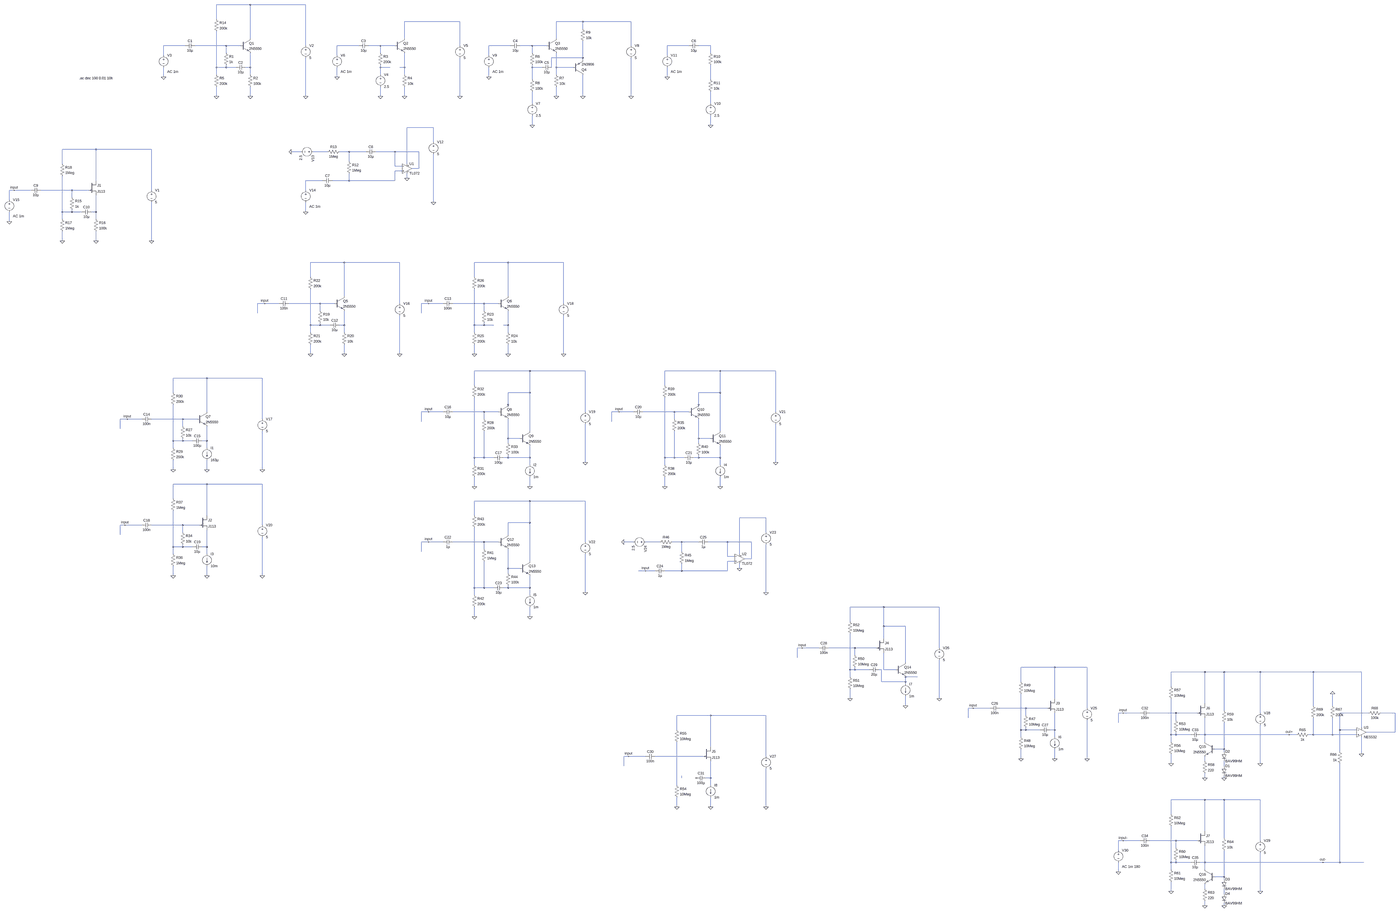
[diagram p0: schematic discrete_input.asc, whole sheet]
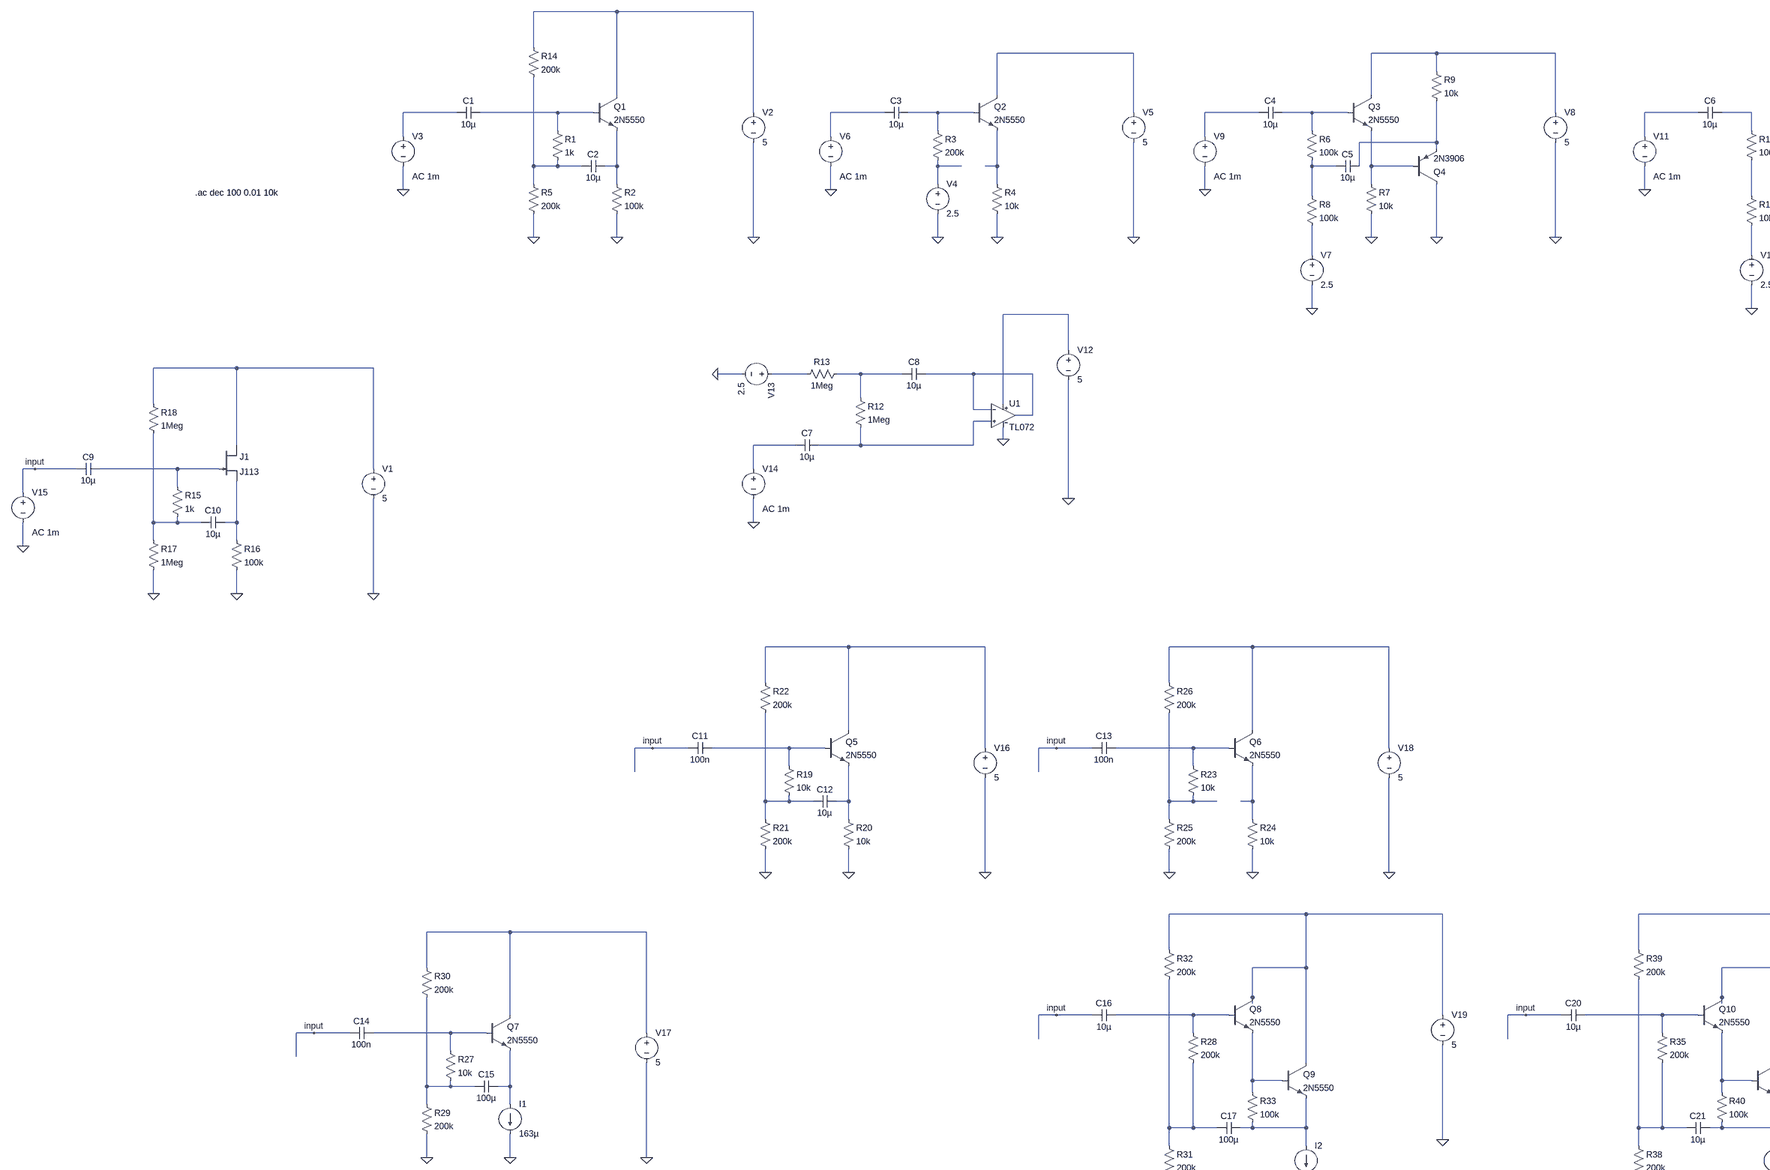
[diagram p1: schematic discrete_input.asc, part, row 1 of 2, column 1 of 2]
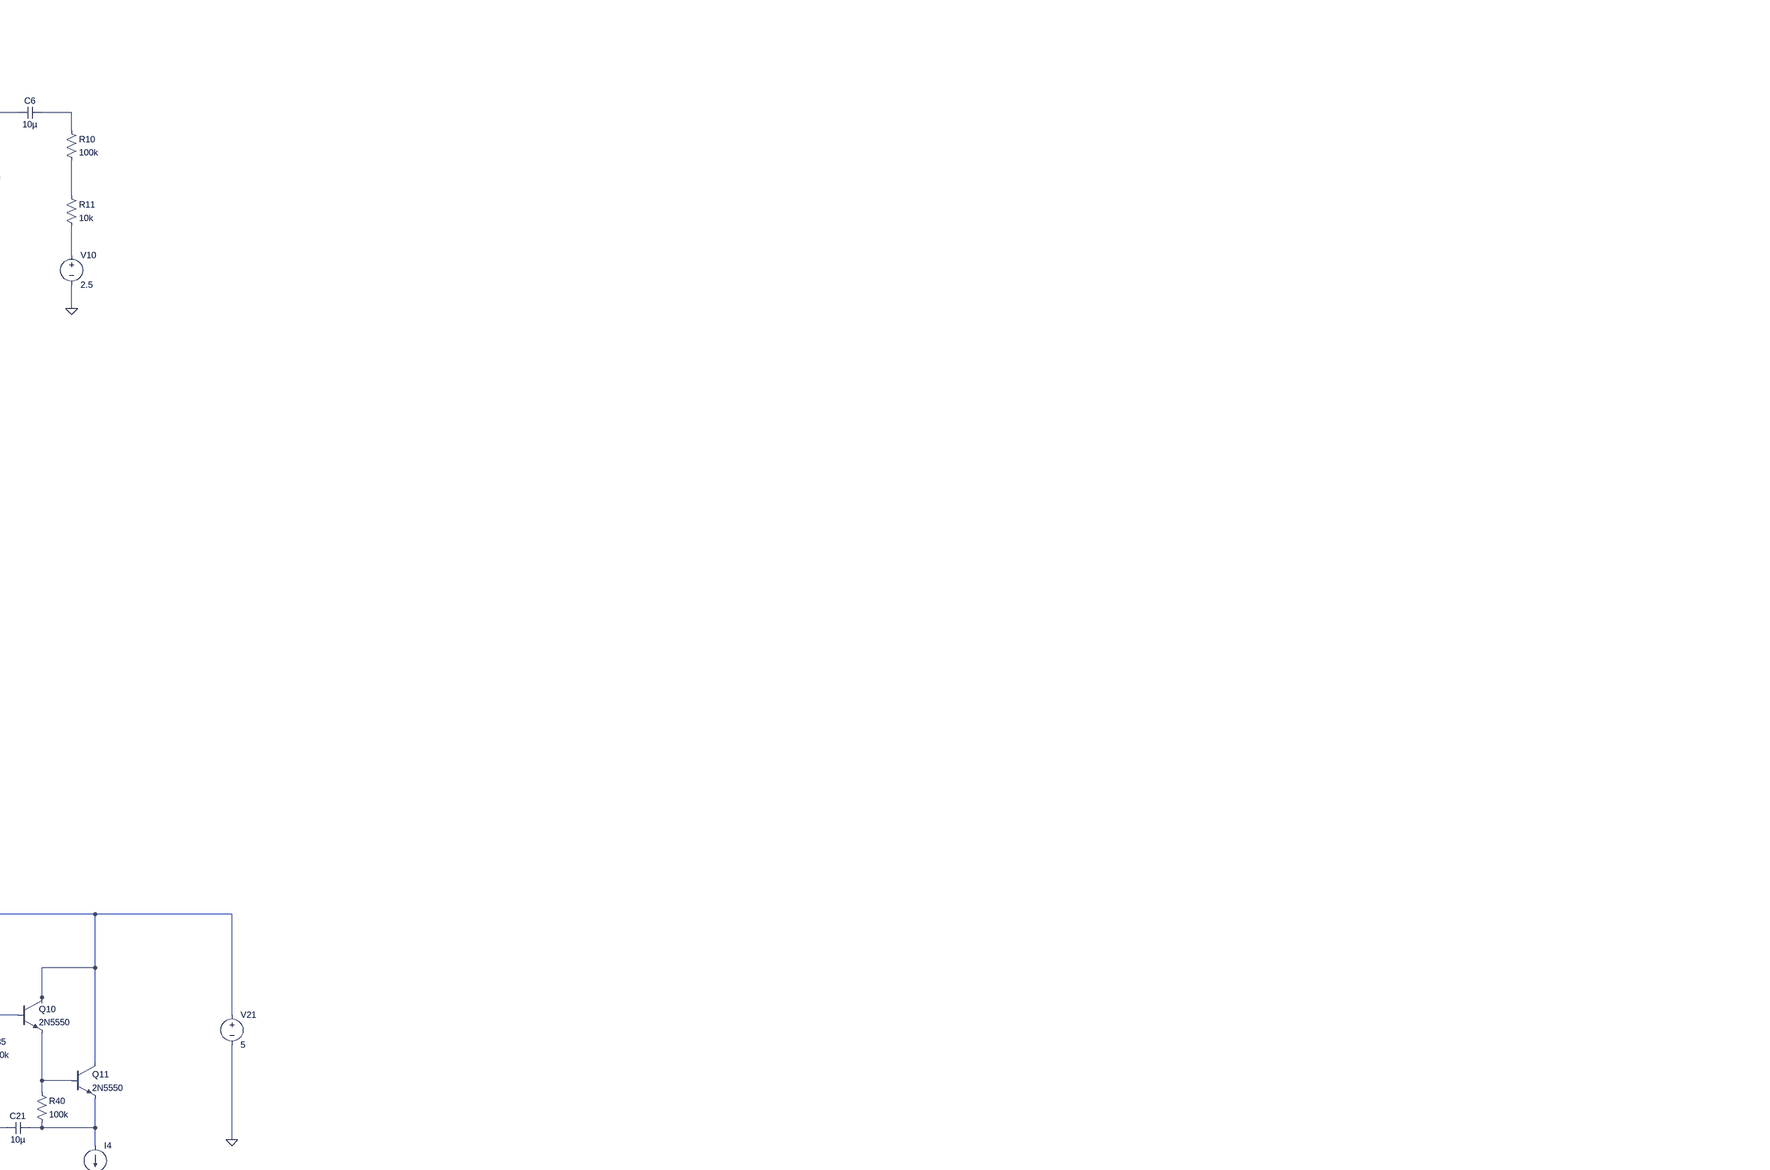
[diagram p2: schematic discrete_input.asc, part, row 1 of 2, column 2 of 2]
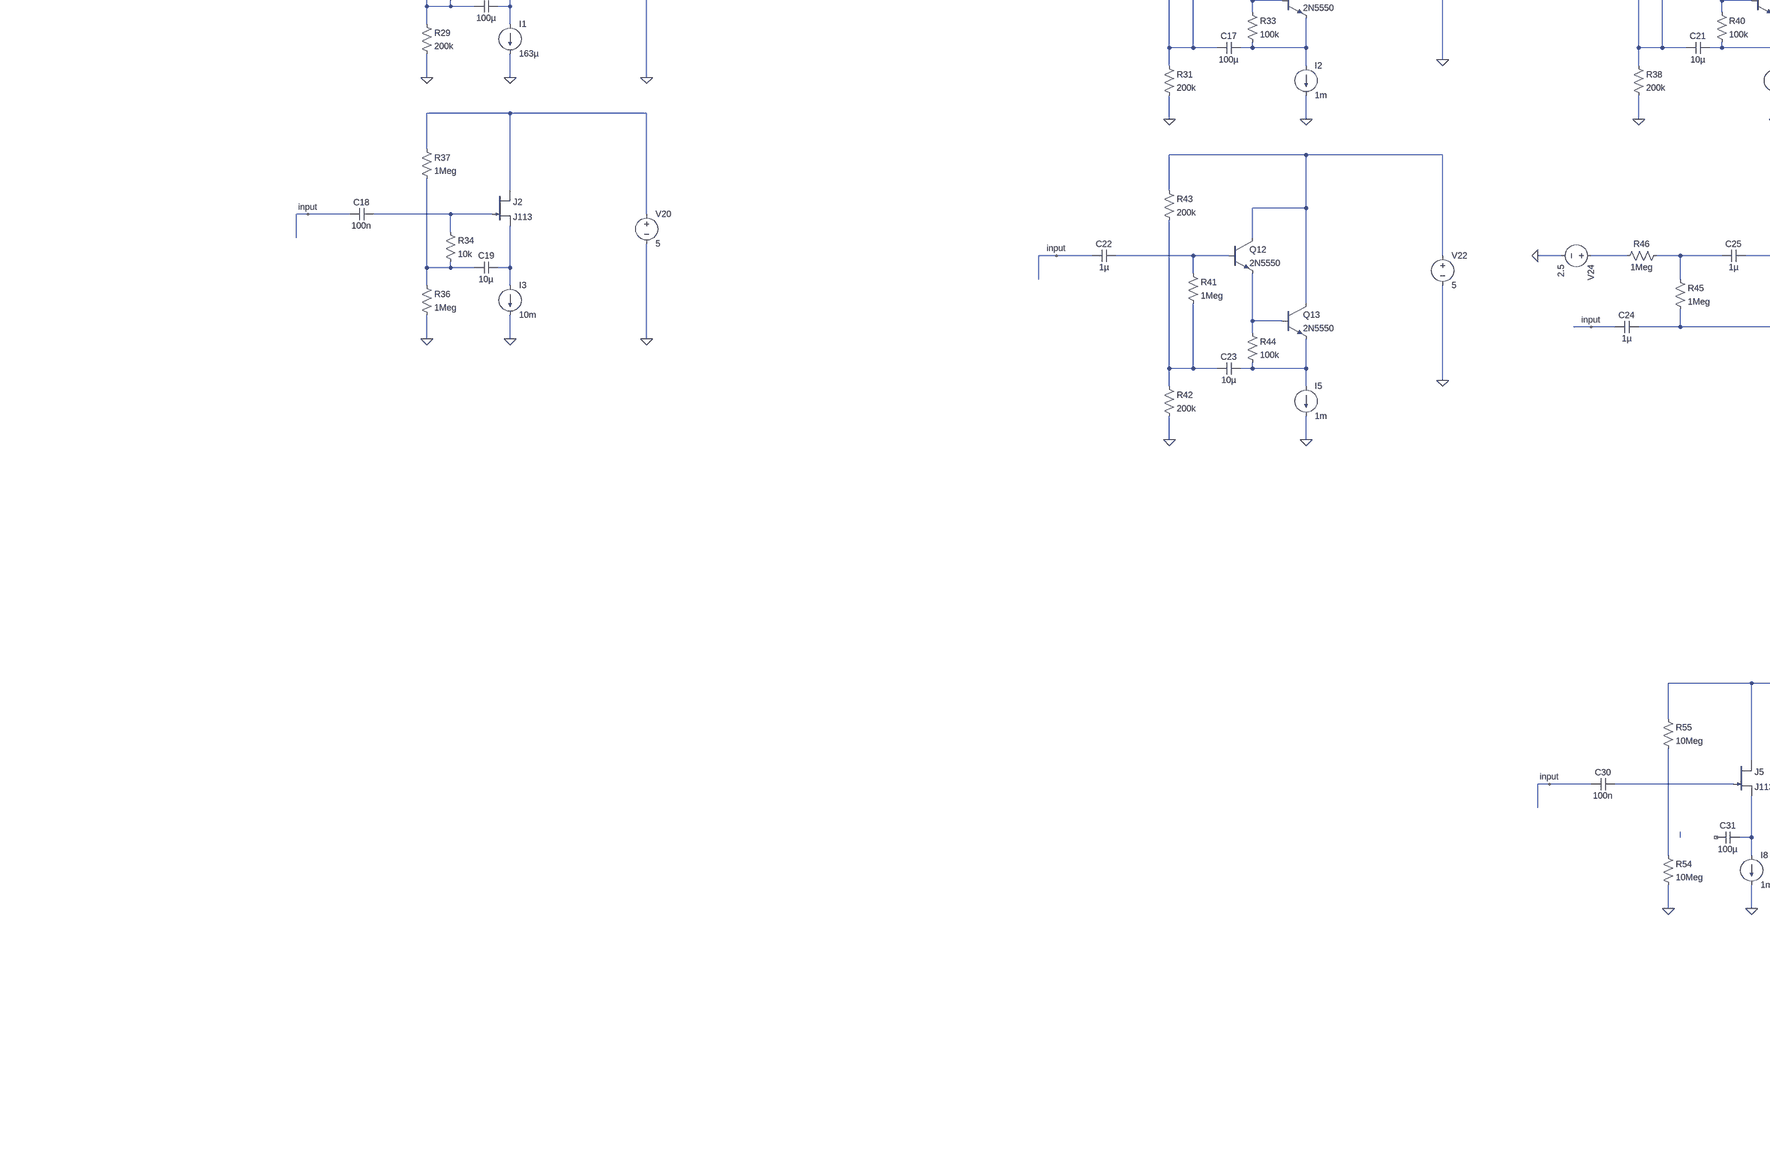
[diagram p3: schematic discrete_input.asc, part, row 2 of 2, column 1 of 2]
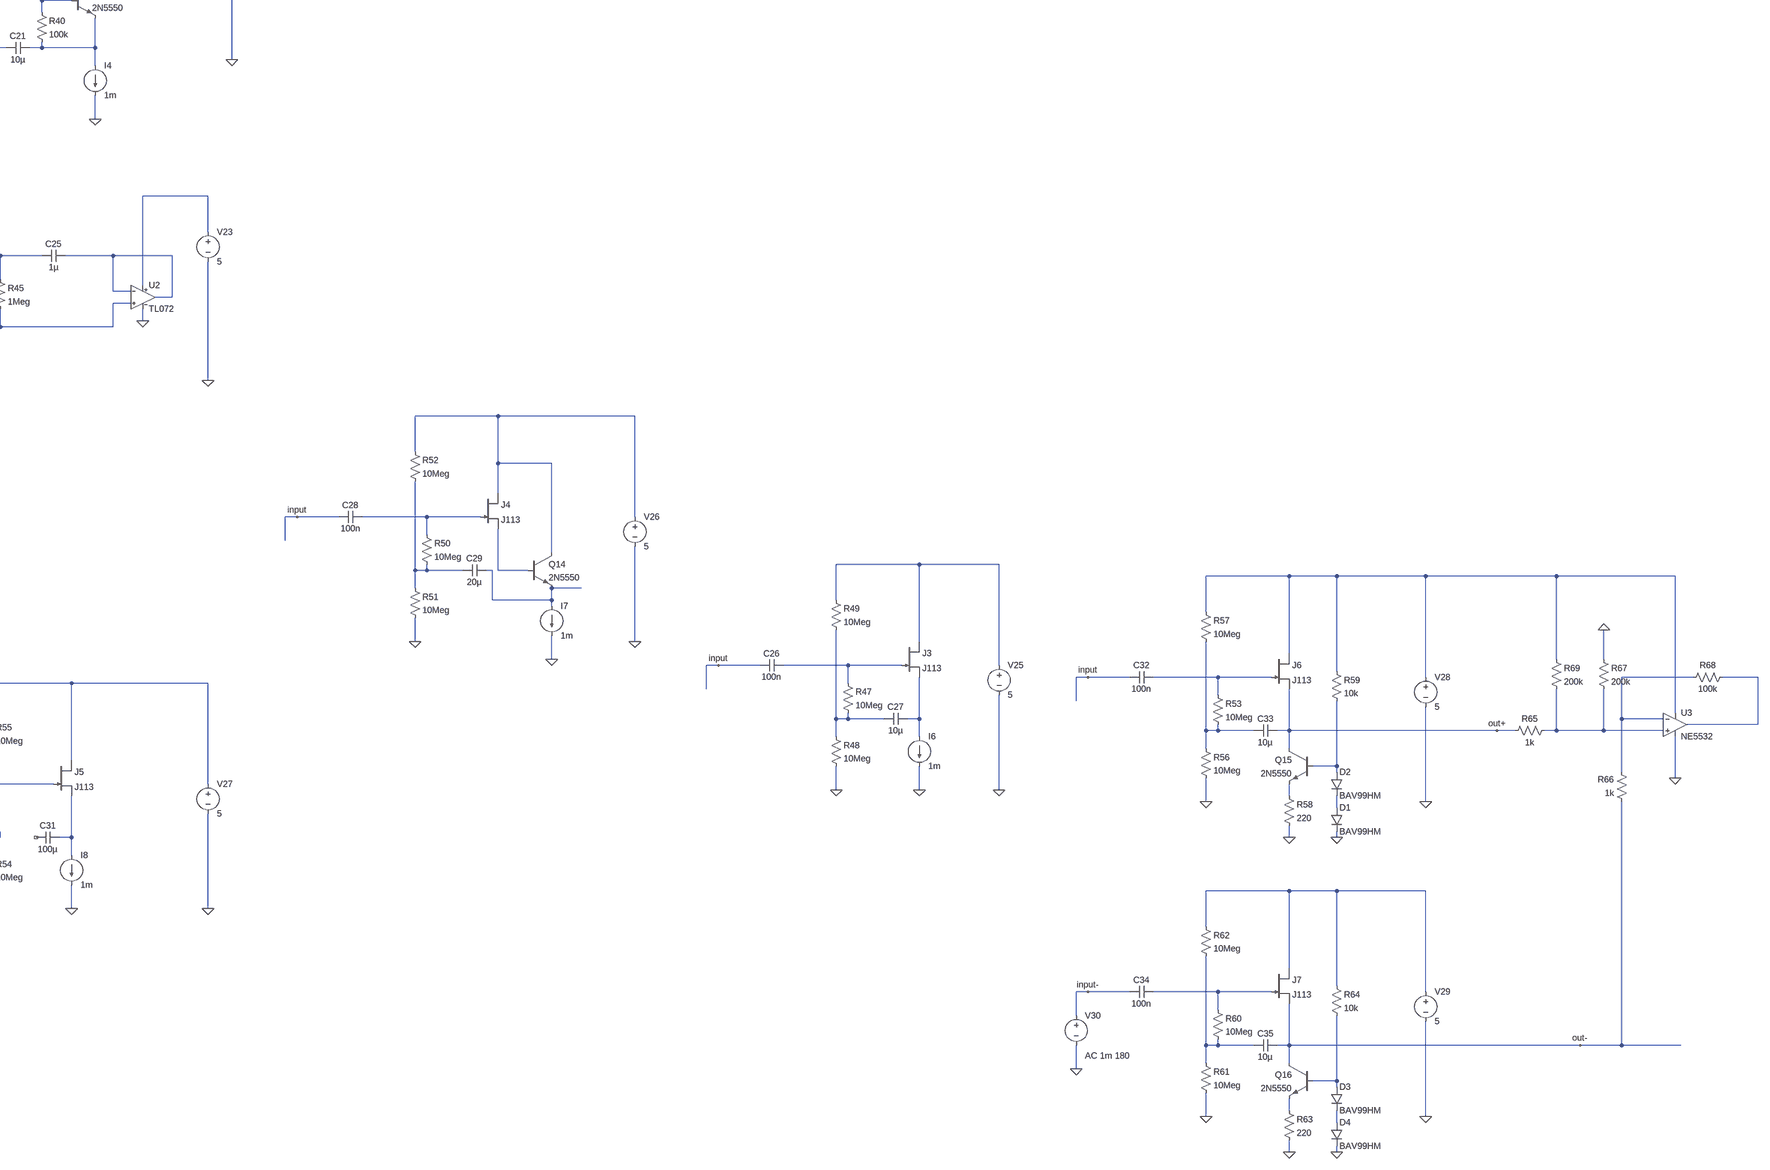
[diagram p4: schematic discrete_input.asc, part, row 2 of 2, column 2 of 2]
discrete_input.asc, the LTspice schematic file:
Version 4
SHEET 1 9284 5940
WIRE 208 -64 -16 -64
WIRE 576 -64 208 -64
WIRE -16 32 -16 -64
WIRE 1600 48 1232 48
WIRE 2416 48 2240 48
WIRE 2736 48 2416 48
WIRE 2416 96 2416 48
WIRE 208 160 208 -64
WIRE 1232 160 1232 48
WIRE 2240 160 2240 48
WIRE -224 208 -368 208
WIRE 48 208 -160 208
WIRE 144 208 48 208
WIRE 576 208 576 -64
WIRE 928 208 784 208
WIRE 1072 208 992 208
WIRE 1168 208 1072 208
WIRE 1600 208 1600 48
WIRE 1936 208 1792 208
WIRE 2080 208 2000 208
WIRE 2176 208 2080 208
WIRE 2736 208 2736 48
WIRE 3120 208 2976 208
WIRE 3264 208 3184 208
WIRE 48 256 48 208
WIRE 1072 256 1072 208
WIRE 2080 256 2080 208
WIRE 3264 256 3264 208
WIRE -368 272 -368 208
WIRE 784 272 784 208
WIRE 1792 272 1792 208
WIRE 2976 272 2976 208
WIRE 2416 288 2416 176
WIRE 2416 288 2208 288
WIRE 2416 304 2416 288
WIRE -16 352 -16 112
WIRE 48 352 48 336
WIRE 48 352 -16 352
WIRE 112 352 48 352
WIRE 208 352 208 256
WIRE 208 352 176 352
WIRE 1072 352 1072 336
WIRE 1136 352 1072 352
WIRE 1232 352 1232 256
WIRE 1232 352 1200 352
WIRE 2080 352 2080 336
WIRE 2144 352 2080 352
WIRE 2208 352 2208 288
WIRE 2240 352 2240 256
WIRE 2352 352 2240 352
WIRE -16 400 -16 352
WIRE 208 400 208 352
WIRE 1072 400 1072 352
WIRE 1232 400 1232 352
WIRE 2240 400 2240 352
WIRE -368 416 -368 352
WIRE 784 416 784 352
WIRE 1792 416 1792 352
WIRE 2976 416 2976 352
WIRE 2080 432 2080 352
WIRE 3264 432 3264 336
WIRE -16 544 -16 480
WIRE 208 544 208 480
WIRE 576 544 576 288
WIRE 1072 544 1072 480
WIRE 1232 544 1232 480
WIRE 1600 544 1600 288
WIRE 2240 544 2240 480
WIRE 2416 544 2416 400
WIRE 2736 544 2736 288
WIRE 2080 592 2080 512
WIRE 3264 592 3264 512
WIRE 2080 736 2080 672
WIRE 3264 736 3264 672
WIRE 1424 752 1248 752
WIRE 1424 848 1424 752
WIRE -816 896 -1040 896
WIRE -448 896 -816 896
WIRE 544 912 480 912
WIRE 720 912 624 912
WIRE 864 912 800 912
WIRE 976 912 864 912
WIRE 1168 912 1040 912
WIRE 1328 912 1168 912
WIRE 864 976 864 912
WIRE -1040 992 -1040 896
WIRE 1248 992 1248 752
WIRE 1168 1008 1168 912
WIRE 1216 1008 1168 1008
WIRE 1328 1024 1328 912
WIRE 1328 1024 1280 1024
WIRE 1216 1040 1168 1040
WIRE 1248 1088 1248 1056
WIRE -816 1104 -816 896
WIRE 688 1104 576 1104
WIRE 864 1104 864 1056
WIRE 864 1104 752 1104
WIRE 1168 1104 1168 1040
WIRE 1168 1104 864 1104
WIRE -1360 1168 -1392 1168
WIRE -1248 1168 -1360 1168
WIRE -976 1168 -1184 1168
WIRE -864 1168 -976 1168
WIRE -448 1168 -448 896
WIRE 576 1168 576 1104
WIRE -976 1216 -976 1168
WIRE -1392 1232 -1392 1168
WIRE 1424 1248 1424 928
WIRE -1040 1312 -1040 1072
WIRE -976 1312 -976 1296
WIRE -976 1312 -1040 1312
WIRE -912 1312 -976 1312
WIRE -816 1312 -816 1200
WIRE -816 1312 -848 1312
WIRE 576 1312 576 1248
WIRE -1040 1360 -1040 1312
WIRE -816 1360 -816 1312
WIRE -1392 1376 -1392 1312
WIRE -1040 1504 -1040 1440
WIRE -816 1504 -816 1440
WIRE -448 1504 -448 1248
WIRE 832 1648 608 1648
WIRE 1200 1648 832 1648
WIRE 1920 1648 1696 1648
WIRE 2288 1648 1920 1648
WIRE 608 1744 608 1648
WIRE 1696 1744 1696 1648
WIRE 832 1872 832 1648
WIRE 1920 1872 1920 1648
WIRE 304 1920 256 1920
WIRE 400 1920 304 1920
WIRE 672 1920 464 1920
WIRE 768 1920 672 1920
WIRE 1200 1920 1200 1648
WIRE 1392 1920 1344 1920
WIRE 1488 1920 1392 1920
WIRE 1760 1920 1552 1920
WIRE 1856 1920 1760 1920
WIRE 2288 1920 2288 1648
WIRE 672 1968 672 1920
WIRE 1760 1968 1760 1920
WIRE 256 1984 256 1920
WIRE 1344 1984 1344 1920
WIRE 608 2064 608 1824
WIRE 672 2064 672 2048
WIRE 672 2064 608 2064
WIRE 736 2064 672 2064
WIRE 832 2064 832 1968
WIRE 832 2064 800 2064
WIRE 1696 2064 1696 1824
WIRE 1760 2064 1760 2048
WIRE 1760 2064 1696 2064
WIRE 1824 2064 1760 2064
WIRE 1920 2064 1920 1968
WIRE 1920 2064 1888 2064
WIRE 608 2112 608 2064
WIRE 832 2112 832 2064
WIRE 1696 2112 1696 2064
WIRE 1920 2112 1920 2064
WIRE 608 2256 608 2192
WIRE 832 2256 832 2192
WIRE 1200 2256 1200 2000
WIRE 1696 2256 1696 2192
WIRE 1920 2256 1920 2192
WIRE 2288 2256 2288 2000
WIRE 2064 2368 1696 2368
WIRE 2432 2368 2064 2368
WIRE 3328 2368 2960 2368
WIRE 3696 2368 3328 2368
WIRE -80 2416 -304 2416
WIRE 288 2416 -80 2416
WIRE 1696 2464 1696 2368
WIRE 2960 2464 2960 2368
WIRE -304 2512 -304 2416
WIRE 2064 2512 2064 2368
WIRE 2064 2512 1920 2512
WIRE 3328 2512 3328 2368
WIRE 3328 2512 3184 2512
WIRE 1920 2592 1920 2512
WIRE 3184 2592 3184 2512
WIRE 1920 2608 1920 2592
WIRE 3184 2608 3184 2592
WIRE -80 2640 -80 2416
WIRE 1392 2640 1344 2640
WIRE 1488 2640 1392 2640
WIRE 1760 2640 1552 2640
WIRE 1856 2640 1760 2640
WIRE 2432 2640 2432 2368
WIRE 2656 2640 2608 2640
WIRE 2752 2640 2656 2640
WIRE 3024 2640 2816 2640
WIRE 3120 2640 3024 2640
WIRE 3696 2640 3696 2368
WIRE -608 2688 -656 2688
WIRE -512 2688 -608 2688
WIRE -240 2688 -448 2688
WIRE -144 2688 -240 2688
WIRE 288 2688 288 2416
WIRE 1760 2688 1760 2640
WIRE 3024 2688 3024 2640
WIRE 1344 2704 1344 2640
WIRE 2608 2704 2608 2640
WIRE -240 2736 -240 2688
WIRE -656 2752 -656 2688
WIRE 2064 2768 2064 2512
WIRE 3328 2768 3328 2512
WIRE 1920 2816 1920 2688
WIRE 2000 2816 1920 2816
WIRE 3184 2816 3184 2688
WIRE 3264 2816 3184 2816
WIRE -304 2832 -304 2592
WIRE -240 2832 -240 2816
WIRE -240 2832 -304 2832
WIRE -176 2832 -240 2832
WIRE -80 2832 -80 2736
WIRE -80 2832 -112 2832
WIRE 1920 2848 1920 2816
WIRE 3184 2848 3184 2816
WIRE -304 2880 -304 2832
WIRE -80 2880 -80 2832
WIRE 1696 2944 1696 2544
WIRE 1760 2944 1760 2768
WIRE 1760 2944 1696 2944
WIRE 1824 2944 1760 2944
WIRE 1920 2944 1920 2928
WIRE 1920 2944 1888 2944
WIRE 2064 2944 2064 2864
WIRE 2064 2944 1920 2944
WIRE 2960 2944 2960 2544
WIRE 3024 2944 3024 2768
WIRE 3024 2944 2960 2944
WIRE 3088 2944 3024 2944
WIRE 3184 2944 3184 2928
WIRE 3184 2944 3152 2944
WIRE 3328 2944 3328 2864
WIRE 3328 2944 3184 2944
WIRE 2432 2976 2432 2720
WIRE 3696 2976 3696 2720
WIRE 1696 2992 1696 2944
WIRE 2064 2992 2064 2944
WIRE 2960 2992 2960 2944
WIRE 3328 2992 3328 2944
WIRE -304 3024 -304 2960
WIRE -80 3024 -80 2960
WIRE 288 3024 288 2768
WIRE -80 3120 -304 3120
WIRE 288 3120 -80 3120
WIRE 1696 3136 1696 3072
WIRE 2064 3136 2064 3072
WIRE 2960 3136 2960 3072
WIRE 3328 3136 3328 3072
WIRE -304 3216 -304 3120
WIRE 2064 3232 1696 3232
WIRE 2432 3232 2064 3232
WIRE -80 3328 -80 3120
WIRE 1696 3328 1696 3232
WIRE 3632 3344 3456 3344
WIRE 2064 3376 2064 3232
WIRE 2064 3376 1920 3376
WIRE -624 3392 -656 3392
WIRE -512 3392 -624 3392
WIRE -240 3392 -448 3392
WIRE -128 3392 -240 3392
WIRE 288 3392 288 3120
WIRE -240 3440 -240 3392
WIRE 3632 3440 3632 3344
WIRE -656 3456 -656 3392
WIRE 1920 3456 1920 3376
WIRE 1392 3504 1344 3504
WIRE 1488 3504 1392 3504
WIRE 1760 3504 1552 3504
WIRE 1856 3504 1760 3504
WIRE 2432 3504 2432 3232
WIRE 2752 3504 2688 3504
WIRE 2928 3504 2832 3504
WIRE 3072 3504 3008 3504
WIRE 3184 3504 3072 3504
WIRE 3376 3504 3248 3504
WIRE 3536 3504 3376 3504
WIRE -304 3536 -304 3296
WIRE -240 3536 -240 3520
WIRE -240 3536 -304 3536
WIRE -176 3536 -240 3536
WIRE -80 3536 -80 3424
WIRE -80 3536 -112 3536
WIRE 1760 3552 1760 3504
WIRE 1344 3568 1344 3504
WIRE 3072 3568 3072 3504
WIRE -304 3584 -304 3536
WIRE -80 3584 -80 3536
WIRE 3456 3584 3456 3344
WIRE 3376 3600 3376 3504
WIRE 3424 3600 3376 3600
WIRE 3536 3616 3536 3504
WIRE 3536 3616 3488 3616
WIRE 2064 3632 2064 3376
WIRE 3424 3632 3376 3632
WIRE 1920 3680 1920 3552
WIRE 2000 3680 1920 3680
WIRE 3456 3680 3456 3648
WIRE 2832 3696 2784 3696
WIRE 2896 3696 2832 3696
WIRE 3072 3696 3072 3648
WIRE 3072 3696 2960 3696
WIRE 3376 3696 3376 3632
WIRE 3376 3696 3072 3696
WIRE 1920 3712 1920 3680
WIRE -304 3728 -304 3664
WIRE -80 3728 -80 3664
WIRE 288 3728 288 3472
WIRE 1696 3808 1696 3408
WIRE 1760 3808 1760 3632
WIRE 1760 3808 1696 3808
WIRE 1824 3808 1760 3808
WIRE 1920 3808 1920 3792
WIRE 1920 3808 1888 3808
WIRE 2064 3808 2064 3728
WIRE 2064 3808 1920 3808
WIRE 2432 3840 2432 3584
WIRE 3632 3840 3632 3520
WIRE 1696 3856 1696 3808
WIRE 2064 3856 2064 3808
WIRE 4416 3936 4192 3936
WIRE 4784 3936 4416 3936
WIRE 1696 4000 1696 3936
WIRE 2064 4000 2064 3936
WIRE 4192 4032 4192 3936
WIRE 4416 4064 4416 3936
WIRE 4560 4064 4416 4064
WIRE 4416 4144 4416 4064
WIRE 3872 4208 3840 4208
WIRE 3984 4208 3872 4208
WIRE 4224 4208 4048 4208
WIRE 4368 4208 4224 4208
WIRE 4784 4208 4784 3936
WIRE 4224 4256 4224 4208
WIRE 3840 4272 3840 4208
WIRE 4560 4304 4560 4064
WIRE 6864 4336 6640 4336
WIRE 7232 4336 6864 4336
WIRE 4192 4352 4192 4112
WIRE 4224 4352 4224 4336
WIRE 4224 4352 4192 4352
WIRE 4320 4352 4224 4352
WIRE 4400 4352 4384 4352
WIRE 4416 4352 4416 4240
WIRE 4496 4352 4416 4352
WIRE 8016 4368 7792 4368
WIRE 8144 4368 8016 4368
WIRE 8384 4368 8144 4368
WIRE 8736 4368 8384 4368
WIRE 9056 4368 8736 4368
WIRE 4192 4400 4192 4352
WIRE 4640 4400 4560 4400
WIRE 4400 4432 4400 4352
WIRE 4560 4432 4560 4400
WIRE 4560 4432 4400 4432
WIRE 6640 4432 6640 4336
WIRE 4560 4448 4560 4432
WIRE 7792 4464 7792 4368
WIRE 4192 4544 4192 4480
WIRE 4784 4544 4784 4288
WIRE 6864 4544 6864 4336
WIRE 8016 4576 8016 4368
WIRE 4560 4592 4560 4528
WIRE 8736 4592 8736 4368
WIRE 8864 4592 8864 4512
WIRE 6320 4608 6288 4608
WIRE 6432 4608 6320 4608
WIRE 6672 4608 6496 4608
WIRE 6816 4608 6672 4608
WIRE 7232 4608 7232 4336
WIRE 8144 4624 8144 4368
WIRE 7472 4640 7440 4640
WIRE 7584 4640 7472 4640
WIRE 7824 4640 7648 4640
WIRE 7968 4640 7824 4640
WIRE 8384 4640 8384 4368
WIRE 9104 4640 8912 4640
WIRE 9280 4640 9184 4640
WIRE 3264 4656 3040 4656
WIRE 3632 4656 3264 4656
WIRE 6672 4656 6672 4608
WIRE 6288 4672 6288 4608
WIRE 7824 4688 7824 4640
WIRE 7440 4704 7440 4640
WIRE 9056 4736 9056 4368
WIRE 3040 4752 3040 4656
WIRE 6640 4752 6640 4512
WIRE 6672 4752 6672 4736
WIRE 6672 4752 6640 4752
WIRE 6768 4752 6672 4752
WIRE 6864 4752 6864 4640
WIRE 6864 4752 6832 4752
WIRE 8912 4752 8912 4640
WIRE 9024 4752 8912 4752
WIRE 9280 4768 9280 4640
WIRE 9280 4768 9088 4768
WIRE 7792 4784 7792 4544
WIRE 7824 4784 7824 4768
WIRE 7824 4784 7792 4784
WIRE 7920 4784 7824 4784
WIRE 8016 4784 8016 4672
WIRE 8016 4784 7984 4784
WIRE 8576 4784 8016 4784
WIRE 8624 4784 8576 4784
WIRE 8736 4784 8736 4672
WIRE 8736 4784 8704 4784
WIRE 8864 4784 8864 4672
WIRE 8864 4784 8736 4784
WIRE 9024 4784 8864 4784
WIRE 6640 4800 6640 4752
WIRE 6864 4800 6864 4752
WIRE 7792 4832 7792 4784
WIRE 8016 4832 8016 4784
WIRE 3264 4864 3264 4656
WIRE 8144 4880 8144 4704
WIRE 8144 4880 8080 4880
WIRE 8144 4896 8144 4880
WIRE 8912 4896 8912 4752
WIRE 9056 4912 9056 4800
WIRE 2720 4928 2688 4928
WIRE 2832 4928 2720 4928
WIRE 3216 4928 2896 4928
WIRE 3632 4928 3632 4656
WIRE 6640 4944 6640 4880
WIRE 6864 4944 6864 4880
WIRE 7232 4944 7232 4688
WIRE 8016 4960 8016 4928
WIRE 7792 4976 7792 4912
WIRE 8384 4976 8384 4720
WIRE 2688 4992 2688 4928
WIRE 8144 4992 8144 4960
WIRE 3072 5072 3072 5056
WIRE 3264 5072 3264 4960
WIRE 3264 5072 3232 5072
WIRE 8016 5072 8016 5040
WIRE 8144 5072 8144 5056
WIRE 3040 5120 3040 4832
WIRE 3264 5120 3264 5072
WIRE 8016 5216 7792 5216
WIRE 8144 5216 8016 5216
WIRE 8384 5216 8144 5216
WIRE 3040 5264 3040 5200
WIRE 3264 5264 3264 5200
WIRE 3632 5264 3632 5008
WIRE 7792 5312 7792 5216
WIRE 8016 5424 8016 5216
WIRE 8144 5472 8144 5216
WIRE 7472 5488 7440 5488
WIRE 7584 5488 7472 5488
WIRE 7824 5488 7648 5488
WIRE 7968 5488 7824 5488
WIRE 8384 5488 8384 5216
WIRE 7824 5536 7824 5488
WIRE 7440 5552 7440 5488
WIRE 7792 5632 7792 5392
WIRE 7824 5632 7824 5616
WIRE 7824 5632 7792 5632
WIRE 7920 5632 7824 5632
WIRE 8016 5632 8016 5520
WIRE 8016 5632 7984 5632
WIRE 8800 5632 8016 5632
WIRE 8912 5632 8912 4976
WIRE 8912 5632 8800 5632
WIRE 9072 5632 8912 5632
WIRE 7792 5680 7792 5632
WIRE 8016 5680 8016 5632
WIRE 7440 5696 7440 5632
WIRE 8144 5728 8144 5552
WIRE 8144 5728 8080 5728
WIRE 8144 5744 8144 5728
WIRE 8016 5808 8016 5776
WIRE 7792 5824 7792 5760
WIRE 8384 5824 8384 5568
WIRE 8144 5840 8144 5808
WIRE 8016 5920 8016 5888
WIRE 8144 5920 8144 5904
FLAG -368 416 0
FLAG 208 544 0
FLAG 576 544 0
FLAG 784 416 0
FLAG 1072 544 0
FLAG 1232 544 0
FLAG 1600 544 0
FLAG 1792 416 0
FLAG 2080 736 0
FLAG 2240 544 0
FLAG 2736 544 0
FLAG 2416 544 0
FLAG 2976 416 0
FLAG 3264 736 0
FLAG 1424 1248 0
FLAG 1248 1088 0
FLAG 480 912 0
FLAG 576 1312 0
FLAG -16 544 0
FLAG -1392 1376 0
FLAG -816 1504 0
FLAG -448 1504 0
FLAG -1040 1504 0
FLAG 832 2256 0
FLAG 1200 2256 0
FLAG 608 2256 0
FLAG 1920 2256 0
FLAG 2288 2256 0
FLAG 1696 2256 0
FLAG 1392 1920 input
FLAG 304 1920 input
FLAG -1360 1168 input
FLAG -80 3024 0
FLAG 288 3024 0
FLAG -304 3024 0
FLAG -608 2688 input
FLAG 2064 3136 0
FLAG 2432 2976 0
FLAG 1696 3136 0
FLAG 1392 2640 input
FLAG -80 3728 0
FLAG 288 3728 0
FLAG -304 3728 0
FLAG -624 3392 input
FLAG 3328 3136 0
FLAG 3696 2976 0
FLAG 2960 3136 0
FLAG 2656 2640 input
FLAG 2064 4000 0
FLAG 2432 3840 0
FLAG 1696 4000 0
FLAG 1392 3504 input
FLAG 3632 3840 0
FLAG 3456 3680 0
FLAG 2688 3504 0
FLAG 2832 3696 input
FLAG 6864 4944 0
FLAG 7232 4944 0
FLAG 6640 4944 0
FLAG 6320 4608 input
FLAG 4560 4592 0
FLAG 4784 4544 0
FLAG 4192 4544 0
FLAG 3872 4208 input
FLAG 3264 5264 0
FLAG 3632 5264 0
FLAG 3040 5264 0
FLAG 2720 4928 input
FLAG 8016 5072 0
FLAG 8384 4976 0
FLAG 7792 4976 0
FLAG 7472 4640 input
FLAG 8144 5072 0
FLAG 8016 5920 0
FLAG 8384 5824 0
FLAG 7792 5824 0
FLAG 7472 5488 input-
FLAG 8144 5920 0
FLAG 7440 5696 0
FLAG 8800 5632 out-
FLAG 8576 4784 out+
FLAG 9056 4912 0
FLAG 8864 4512 0
SYMBOL npn 144 160 R0
SYMATTR InstName Q1
SYMATTR Value 2N5550
SYMBOL cap -160 192 R90
WINDOW 0 0 32 VBottom 2
WINDOW 3 32 32 VTop 2
SYMATTR InstName C1
SYMATTR Value 10µ
SYMBOL res 32 240 R0
SYMATTR InstName R1
SYMATTR Value 1k
SYMBOL voltage 576 192 R0
WINDOW 123 0 0 Left 0
WINDOW 39 0 0 Left 0
SYMATTR InstName V2
SYMATTR Value 5
SYMBOL voltage -368 256 R0
WINDOW 123 24 124 Left 2
WINDOW 39 0 0 Left 0
SYMATTR Value2 AC 1m
SYMATTR InstName V3
SYMATTR Value ""
SYMBOL cap 176 336 R90
WINDOW 0 0 32 VBottom 2
WINDOW 3 32 32 VTop 2
SYMATTR InstName C2
SYMATTR Value 10µ
SYMBOL res 192 384 R0
SYMATTR InstName R2
SYMATTR Value 100k
SYMBOL npn 1168 160 R0
SYMATTR InstName Q2
SYMATTR Value 2N5550
SYMBOL cap 992 192 R90
WINDOW 0 0 32 VBottom 2
WINDOW 3 32 32 VTop 2
SYMATTR InstName C3
SYMATTR Value 10µ
SYMBOL res 1056 240 R0
SYMATTR InstName R3
SYMATTR Value 200k
SYMBOL voltage 1072 384 R0
WINDOW 123 0 0 Left 0
WINDOW 39 0 0 Left 0
SYMATTR InstName V4
SYMATTR Value 2.5
SYMBOL voltage 1600 192 R0
WINDOW 123 0 0 Left 0
WINDOW 39 0 0 Left 0
SYMATTR InstName V5
SYMATTR Value 5
SYMBOL voltage 784 256 R0
WINDOW 123 24 124 Left 2
WINDOW 39 0 0 Left 0
SYMATTR Value2 AC 1m
SYMATTR InstName V6
SYMATTR Value ""
SYMBOL res 1216 384 R0
SYMATTR InstName R4
SYMATTR Value 10k
SYMBOL res -32 384 R0
SYMATTR InstName R5
SYMATTR Value 200k
SYMBOL npn 2176 160 R0
SYMATTR InstName Q3
SYMATTR Value 2N5550
SYMBOL cap 2000 192 R90
WINDOW 0 0 32 VBottom 2
WINDOW 3 32 32 VTop 2
SYMATTR InstName C4
SYMATTR Value 10µ
SYMBOL res 2064 240 R0
SYMATTR InstName R6
SYMATTR Value 100k
SYMBOL voltage 2080 576 R0
WINDOW 123 0 0 Left 0
WINDOW 39 0 0 Left 0
SYMATTR InstName V7
SYMATTR Value 2.5
SYMBOL voltage 2736 192 R0
WINDOW 123 0 0 Left 0
WINDOW 39 0 0 Left 0
SYMATTR InstName V8
SYMATTR Value 5
SYMBOL voltage 1792 256 R0
WINDOW 123 24 124 Left 2
WINDOW 39 0 0 Left 0
SYMATTR Value2 AC 1m
SYMATTR InstName V9
SYMATTR Value ""
SYMBOL cap 2208 336 R90
WINDOW 0 0 32 VBottom 2
WINDOW 3 32 32 VTop 2
SYMATTR InstName C5
SYMATTR Value 10µ
SYMBOL res 2224 384 R0
SYMATTR InstName R7
SYMATTR Value 10k
SYMBOL res 2064 416 R0
SYMATTR InstName R8
SYMATTR Value 100k
SYMBOL pnp 2352 400 M180
SYMATTR InstName Q4
SYMATTR Value 2N3906
SYMBOL res 2400 80 R0
SYMATTR InstName R9
SYMATTR Value 10k
SYMBOL cap 3184 192 R90
WINDOW 0 0 32 VBottom 2
WINDOW 3 32 32 VTop 2
SYMATTR InstName C6
SYMATTR Value 10µ
SYMBOL res 3248 240 R0
SYMATTR InstName R10
SYMATTR Value 100k
SYMBOL voltage 3264 576 R0
WINDOW 123 0 0 Left 0
WINDOW 39 0 0 Left 0
SYMATTR InstName V10
SYMATTR Value 2.5
SYMBOL voltage 2976 256 R0
WINDOW 123 24 124 Left 2
WINDOW 39 0 0 Left 0
SYMATTR Value2 AC 1m
SYMATTR InstName V11
SYMATTR Value ""
SYMBOL res 3248 416 R0
SYMATTR InstName R11
SYMATTR Value 10k
SYMBOL ZZZ\\OpAmp\\TL072 1248 1024 R0
SYMATTR InstName U1
SYMBOL voltage 1424 832 R0
WINDOW 123 0 0 Left 0
WINDOW 39 0 0 Left 0
SYMATTR InstName V12
SYMATTR Value 5
SYMBOL res 848 960 R0
SYMATTR InstName R12
SYMATTR Value 1Meg
SYMBOL cap 752 1088 R90
WINDOW 0 0 32 VBottom 2
WINDOW 3 32 32 VTop 2
SYMATTR InstName C7
SYMATTR Value 10µ
SYMBOL cap 1040 896 R90
WINDOW 0 0 32 VBottom 2
WINDOW 3 32 32 VTop 2
SYMATTR InstName C8
SYMATTR Value 10µ
SYMBOL voltage 640 912 R90
WINDOW 123 0 0 Left 0
WINDOW 39 0 0 Left 0
SYMATTR InstName V13
SYMATTR Value 2.5
SYMBOL voltage 576 1152 R0
WINDOW 123 24 124 Left 2
WINDOW 39 0 0 Left 0
SYMATTR Value2 AC 1m
SYMATTR InstName V14
SYMATTR Value ""
SYMBOL res 816 896 R90
WINDOW 0 0 56 VBottom 2
WINDOW 3 32 56 VTop 2
SYMATTR InstName R13
SYMATTR Value 1Meg
SYMBOL res -32 16 R0
SYMATTR InstName R14
SYMATTR Value 200k
SYMBOL cap -1184 1152 R90
WINDOW 0 0 32 VBottom 2
WINDOW 3 32 32 VTop 2
SYMATTR InstName C9
SYMATTR Value 10µ
SYMBOL res -992 1200 R0
SYMATTR InstName R15
SYMATTR Value 1k
SYMBOL voltage -448 1152 R0
WINDOW 123 0 0 Left 0
WINDOW 39 0 0 Left 0
SYMATTR InstName V1
SYMATTR Value 5
SYMBOL voltage -1392 1216 R0
WINDOW 123 24 124 Left 2
WINDOW 39 0 0 Left 0
SYMATTR Value2 AC 1m
SYMATTR InstName V15
SYMATTR Value ""
SYMBOL cap -848 1296 R90
WINDOW 0 0 32 VBottom 2
WINDOW 3 32 32 VTop 2
SYMATTR InstName C10
SYMATTR Value 10µ
SYMBOL res -832 1344 R0
SYMATTR InstName R16
SYMATTR Value 100k
SYMBOL res -1056 1344 R0
SYMATTR InstName R17
SYMATTR Value 1Meg
SYMBOL res -1056 976 R0
SYMATTR InstName R18
SYMATTR Value 1Meg
SYMBOL njf -864 1104 R0
SYMATTR InstName J1
SYMATTR Value J113
SYMBOL npn 768 1872 R0
SYMATTR InstName Q5
SYMATTR Value 2N5550
SYMBOL cap 464 1904 R90
WINDOW 0 0 32 VBottom 2
WINDOW 3 32 32 VTop 2
SYMATTR InstName C11
SYMATTR Value 100n
SYMBOL res 656 1952 R0
SYMATTR InstName R19
SYMATTR Value 10k
SYMBOL voltage 1200 1904 R0
WINDOW 123 0 0 Left 0
WINDOW 39 0 0 Left 0
SYMATTR InstName V16
SYMATTR Value 5
SYMBOL cap 800 2048 R90
WINDOW 0 0 32 VBottom 2
WINDOW 3 32 32 VTop 2
SYMATTR InstName C12
SYMATTR Value 10µ
SYMBOL res 816 2096 R0
SYMATTR InstName R20
SYMATTR Value 10k
SYMBOL res 592 2096 R0
SYMATTR InstName R21
SYMATTR Value 200k
SYMBOL res 592 1728 R0
SYMATTR InstName R22
SYMATTR Value 200k
SYMBOL npn 1856 1872 R0
SYMATTR InstName Q6
SYMATTR Value 2N5550
SYMBOL cap 1552 1904 R90
WINDOW 0 0 32 VBottom 2
WINDOW 3 32 32 VTop 2
SYMATTR InstName C13
SYMATTR Value 100n
SYMBOL res 1744 1952 R0
SYMATTR InstName R23
SYMATTR Value 10k
SYMBOL voltage 2288 1904 R0
WINDOW 123 0 0 Left 0
WINDOW 39 0 0 Left 0
SYMATTR InstName V18
SYMATTR Value 5
SYMBOL res 1904 2096 R0
SYMATTR InstName R24
SYMATTR Value 10k
SYMBOL res 1680 2096 R0
SYMATTR InstName R25
SYMATTR Value 200k
SYMBOL res 1680 1728 R0
SYMATTR InstName R26
SYMATTR Value 200k
SYMBOL npn -144 2640 R0
SYMATTR InstName Q7
SYMATTR Value 2N5550
SYMBOL cap -448 2672 R90
WINDOW 0 0 32 VBottom 2
WINDOW 3 32 32 VTop 2
SYMATTR InstName C14
SYMATTR Value 100n
SYMBOL res -256 2720 R0
SYMATTR InstName R27
SYMATTR Value 10k
SYMBOL voltage 288 2672 R0
WINDOW 123 0 0 Left 0
WINDOW 39 0 0 Left 0
SYMATTR InstName V17
SYMATTR Value 5
SYMBOL cap -112 2816 R90
WINDOW 0 0 32 VBottom 2
WINDOW 3 32 32 VTop 2
SYMATTR InstName C15
SYMATTR Value 100µ
SYMBOL res -320 2864 R0
SYMATTR InstName R29
SYMATTR Value 200k
SYMBOL res -320 2496 R0
SYMATTR InstName R30
SYMATTR Value 200k
SYMBOL current -80 2880 R0
WINDOW 123 0 0 Left 0
WINDOW 39 0 0 Left 0
SYMATTR InstName I1
SYMATTR Value 163µ
SYMBOL npn 1856 2592 R0
SYMATTR InstName Q8
SYMATTR Value 2N5550
SYMBOL cap 1552 2624 R90
WINDOW 0 0 32 VBottom 2
WINDOW 3 32 32 VTop 2
SYMATTR InstName C16
SYMATTR Value 10µ
SYMBOL res 1744 2672 R0
SYMATTR InstName R28
SYMATTR Value 200k
SYMBOL voltage 2432 2624 R0
WINDOW 123 0 0 Left 0
WINDOW 39 0 0 Left 0
SYMATTR InstName V19
SYMATTR Value 5
SYMBOL cap 1888 2928 R90
WINDOW 0 0 32 VBottom 2
WINDOW 3 32 32 VTop 2
SYMATTR InstName C17
SYMATTR Value 100µ
SYMBOL res 1680 2976 R0
SYMATTR InstName R31
SYMATTR Value 200k
SYMBOL res 1680 2448 R0
SYMATTR InstName R32
SYMATTR Value 200k
SYMBOL current 2064 2992 R0
WINDOW 123 0 0 Left 0
WINDOW 39 0 0 Left 0
SYMATTR InstName I2
SYMATTR Value 1m
SYMBOL npn 2000 2768 R0
SYMATTR InstName Q9
SYMATTR Value 2N5550
SYMBOL res 1904 2832 R0
SYMATTR InstName R33
SYMATTR Value 100k
SYMBOL cap -448 3376 R90
WINDOW 0 0 32 VBottom 2
WINDOW 3 32 32 VTop 2
SYMATTR InstName C18
SYMATTR Value 100n
SYMBOL res -256 3424 R0
SYMATTR InstName R34
SYMATTR Value 10k
SYMBOL voltage 288 3376 R0
WINDOW 123 0 0 Left 0
WINDOW 39 0 0 Left 0
SYMATTR InstName V20
SYMATTR Value 5
SYMBOL cap -112 3520 R90
WINDOW 0 0 32 VBottom 2
WINDOW 3 32 32 VTop 2
SYMATTR InstName C19
SYMATTR Value 10µ
SYMBOL res -320 3568 R0
SYMATTR InstName R36
SYMATTR Value 1Meg
SYMBOL res -320 3200 R0
SYMATTR InstName R37
SYMATTR Value 1Meg
SYMBOL njf -128 3328 R0
SYMATTR InstName J2
SYMATTR Value J113
SYMBOL current -80 3584 R0
WINDOW 123 0 0 Left 0
WINDOW 39 0 0 Left 0
SYMATTR InstName I3
SYMATTR Value 10m
SYMBOL npn 3120 2592 R0
SYMATTR InstName Q10
SYMATTR Value 2N5550
SYMBOL cap 2816 2624 R90
WINDOW 0 0 32 VBottom 2
WINDOW 3 32 32 VTop 2
SYMATTR InstName C20
SYMATTR Value 10µ
SYMBOL res 3008 2672 R0
SYMATTR InstName R35
SYMATTR Value 200k
SYMBOL voltage 3696 2624 R0
WINDOW 123 0 0 Left 0
WINDOW 39 0 0 Left 0
SYMATTR InstName V21
SYMATTR Value 5
SYMBOL res 2944 2976 R0
SYMATTR InstName R38
SYMATTR Value 200k
SYMBOL res 2944 2448 R0
SYMATTR InstName R39
SYMATTR Value 200k
SYMBOL current 3328 2992 R0
WINDOW 123 0 0 Left 0
WINDOW 39 0 0 Left 0
SYMATTR InstName I4
SYMATTR Value 1m
SYMBOL npn 3264 2768 R0
SYMATTR InstName Q11
SYMATTR Value 2N5550
SYMBOL res 3168 2832 R0
SYMATTR InstName R40
SYMATTR Value 100k
SYMBOL cap 3152 2928 R90
WINDOW 0 0 32 VBottom 2
WINDOW 3 32 32 VTop 2
SYMATTR InstName C21
SYMATTR Value 10µ
SYMBOL npn 1856 3456 R0
SYMATTR InstName Q12
SYMATTR Value 2N5550
SYMBOL cap 1552 3488 R90
WINDOW 0 0 32 VBottom 2
WINDOW 3 32 32 VTop 2
SYMATTR InstName C22
SYMATTR Value 1µ
SYMBOL res 1744 3536 R0
SYMATTR InstName R41
SYMATTR Value 1Meg
SYMBOL voltage 2432 3488 R0
WINDOW 123 0 0 Left 0
WINDOW 39 0 0 Left 0
SYMATTR InstName V22
SYMATTR Value 5
SYMBOL cap 1888 3792 R90
WINDOW 0 0 32 VBottom 2
WINDOW 3 32 32 VTop 2
SYMATTR InstName C23
SYMATTR Value 10µ
SYMBOL res 1680 3840 R0
SYMATTR InstName R42
SYMATTR Value 200k
SYMBOL res 1680 3312 R0
SYMATTR InstName R43
SYMATTR Value 200k
SYMBOL current 2064 3856 R0
WINDOW 123 0 0 Left 0
WINDOW 39 0 0 Left 0
SYMATTR InstName I5
SYMATTR Value 1m
SYMBOL npn 2000 3632 R0
SYMATTR InstName Q13
SYMATTR Value 2N5550
SYMBOL res 1904 3696 R0
SYMATTR InstName R44
SYMATTR Value 100k
SYMBOL ZZZ\\OpAmp\\TL072 3456 3616 R0
SYMATTR InstName U2
SYMBOL voltage 3632 3424 R0
WINDOW 123 0 0 Left 0
WINDOW 39 0 0 Left 0
SYMATTR InstName V23
SYMATTR Value 5
SYMBOL res 3056 3552 R0
SYMATTR InstName R45
SYMATTR Value 1Meg
SYMBOL cap 2960 3680 R90
WINDOW 0 0 32 VBottom 2
WINDOW 3 32 32 VTop 2
SYMATTR InstName C24
SYMATTR Value 1µ
SYMBOL cap 3248 3488 R90
WINDOW 0 0 32 VBottom 2
WINDOW 3 32 32 VTop 2
SYMATTR InstName C25
SYMATTR Value 1µ
SYMBOL voltage 2848 3504 R90
WINDOW 123 0 0 Left 0
WINDOW 39 0 0 Left 0
SYMATTR InstName V24
SYMATTR Value 2.5
SYMBOL res 3024 3488 R90
WINDOW 0 0 56 VBottom 2
WINDOW 3 32 56 VTop 2
SYMATTR InstName R46
SYMATTR Value 1Meg
SYMBOL cap 6496 4592 R90
WINDOW 0 0 32 VBottom 2
WINDOW 3 32 32 VTop 2
SYMATTR InstName C26
SYMATTR Value 100n
SYMBOL res 6656 4640 R0
SYMATTR InstName R47
SYMATTR Value 10Meg
SYMBOL voltage 7232 4592 R0
WINDOW 123 0 0 Left 0
WINDOW 39 0 0 Left 0
SYMATTR InstName V25
SYMATTR Value 5
SYMBOL cap 6832 4736 R90
WINDOW 0 0 32 VBottom 2
WINDOW 3 32 32 VTop 2
SYMATTR InstName C27
SYMATTR Value 10µ
SYMBOL res 6624 4784 R0
SYMATTR InstName R48
SYMATTR Value 10Meg
SYMBOL res 6624 4416 R0
SYMATTR InstName R49
SYMATTR Value 10Meg
SYMBOL njf 6816 4544 R0
SYMATTR InstName J3
SYMATTR Value J113
SYMBOL current 6864 4800 R0
WINDOW 123 0 0 Left 0
WINDOW 39 0 0 Left 0
SYMATTR InstName I6
SYMATTR Value 1m
SYMBOL cap 4048 4192 R90
WINDOW 0 0 32 VBottom 2
WINDOW 3 32 32 VTop 2
SYMATTR InstName C28
SYMATTR Value 100n
SYMBOL res 4208 4240 R0
SYMATTR InstName R50
SYMATTR Value 10Meg
SYMBOL voltage 4784 4192 R0
WINDOW 123 0 0 Left 0
WINDOW 39 0 0 Left 0
SYMATTR InstName V26
SYMATTR Value 5
SYMBOL cap 4384 4336 R90
WINDOW 0 0 32 VBottom 2
WINDOW 3 32 32 VTop 2
SYMATTR InstName C29
SYMATTR Value 20µ
SYMBOL res 4176 4384 R0
SYMATTR InstName R51
SYMATTR Value 10Meg
SYMBOL res 4176 4016 R0
SYMATTR InstName R52
SYMATTR Value 10Meg
SYMBOL njf 4368 4144 R0
SYMATTR InstName J4
SYMATTR Value J113
SYMBOL current 4560 4448 R0
WINDOW 123 0 0 Left 0
WINDOW 39 0 0 Left 0
SYMATTR InstName I7
SYMATTR Value 1m
SYMBOL npn 4496 4304 R0
SYMATTR InstName Q14
SYMATTR Value 2N5550
SYMBOL cap 2896 4912 R90
WINDOW 0 0 32 VBottom 2
WINDOW 3 32 32 VTop 2
SYMATTR InstName C30
SYMATTR Value 100n
SYMBOL voltage 3632 4912 R0
WINDOW 123 0 0 Left 0
WINDOW 39 0 0 Left 0
SYMATTR InstName V27
SYMATTR Value 5
SYMBOL cap 3232 5056 R90
WINDOW 0 0 32 VBottom 2
WINDOW 3 32 32 VTop 2
SYMATTR InstName C31
SYMATTR Value 100µ
SYMBOL res 3024 5104 R0
SYMATTR InstName R54
SYMATTR Value 10Meg
SYMBOL res 3024 4736 R0
SYMATTR InstName R55
SYMATTR Value 10Meg
SYMBOL njf 3216 4864 R0
SYMATTR InstName J5
SYMATTR Value J113
SYMBOL current 3264 5120 R0
WINDOW 123 0 0 Left 0
WINDOW 39 0 0 Left 0
SYMATTR InstName I8
SYMATTR Value 1m
SYMBOL cap 7648 4624 R90
WINDOW 0 0 32 VBottom 2
WINDOW 3 32 32 VTop 2
SYMATTR InstName C32
SYMATTR Value 100n
SYMBOL res 7808 4672 R0
SYMATTR InstName R53
SYMATTR Value 10Meg
SYMBOL voltage 8384 4624 R0
WINDOW 123 0 0 Left 0
WINDOW 39 0 0 Left 0
SYMATTR InstName V28
SYMATTR Value 5
SYMBOL cap 7984 4768 R90
WINDOW 0 0 32 VBottom 2
WINDOW 3 32 32 VTop 2
SYMATTR InstName C33
SYMATTR Value 10µ
SYMBOL res 7776 4816 R0
SYMATTR InstName R56
SYMATTR Value 10Meg
SYMBOL res 7776 4448 R0
SYMATTR InstName R57
SYMATTR Value 10Meg
SYMBOL njf 7968 4576 R0
SYMATTR InstName J6
SYMATTR Value J113
SYMBOL npn 8080 4832 M0
SYMATTR InstName Q15
SYMATTR Value 2N5550
SYMBOL res 8000 4944 R0
SYMATTR InstName R58
SYMATTR Value 220
SYMBOL diode 8128 4896 R0
SYMATTR InstName D2
SYMATTR Value BAV99HM
SYMBOL diode 8128 4992 R0
SYMATTR InstName D1
SYMATTR Value BAV99HM
SYMBOL res 8128 4608 R0
SYMATTR InstName R59
SYMATTR Value 10k
SYMBOL cap 7648 5472 R90
WINDOW 0 0 32 VBottom 2
WINDOW 3 32 32 VTop 2
SYMATTR InstName C34
SYMATTR Value 100n
SYMBOL res 7808 5520 R0
SYMATTR InstName R60
SYMATTR Value 10Meg
SYMBOL voltage 8384 5472 R0
WINDOW 123 0 0 Left 0
WINDOW 39 0 0 Left 0
SYMATTR InstName V29
SYMATTR Value 5
SYMBOL cap 7984 5616 R90
WINDOW 0 0 32 VBottom 2
WINDOW 3 32 32 VTop 2
SYMATTR InstName C35
SYMATTR Value 10µ
SYMBOL res 7776 5664 R0
SYMATTR InstName R61
SYMATTR Value 10Meg
SYMBOL res 7776 5296 R0
SYMATTR InstName R62
SYMATTR Value 10Meg
SYMBOL njf 7968 5424 R0
SYMATTR InstName J7
SYMATTR Value J113
SYMBOL npn 8080 5680 M0
SYMATTR InstName Q16
SYMATTR Value 2N5550
SYMBOL res 8000 5792 R0
SYMATTR InstName R63
SYMATTR Value 220
SYMBOL diode 8128 5744 R0
SYMATTR InstName D3
SYMATTR Value BAV99HM
SYMBOL diode 8128 5840 R0
SYMATTR InstName D4
SYMATTR Value BAV99HM
SYMBOL res 8128 5456 R0
SYMATTR InstName R64
SYMATTR Value 10k
SYMBOL voltage 7440 5536 R0
WINDOW 123 24 124 Left 2
WINDOW 39 0 0 Left 0
SYMATTR Value2 AC 1m 180
SYMATTR InstName V30
SYMATTR Value ""
SYMBOL ZZZ\\OpAmp\\NE5532 9056 4768 R0
SYMATTR InstName U3
SYMBOL res 8720 4768 R90
WINDOW 0 0 56 VBottom 2
WINDOW 3 32 56 VTop 2
SYMATTR InstName R65
SYMATTR Value 1k
SYMBOL res 8928 4992 R180
WINDOW 0 36 76 Left 2
WINDOW 3 36 40 Left 2
SYMATTR InstName R66
SYMATTR Value 1k
SYMBOL res 8848 4576 R0
SYMATTR InstName R67
SYMATTR Value 200k
SYMBOL res 9200 4624 R90
WINDOW 0 0 56 VBottom 2
WINDOW 3 32 56 VTop 2
SYMATTR InstName R68
SYMATTR Value 100k
SYMBOL res 8720 4576 R0
SYMATTR InstName R69
SYMATTR Value 200k
TEXT -928 424 Left 2 !.ac dec 100 0.01 10k

The netlist it stands for:
* discrete_input.asc
Q1 N001 N005 N014 0 2N5550
C1 N005 N004 10µ
R1 N005 N013 1k
V2 N001 0 5
V3 N004 0 AC 1m
C2 N014 N013 10µ
R2 N014 0 100k
Q2 N002 N007 N016 0 2N5550
C3 N007 N006 10µ
R3 N007 N015 200k
V4 N015 0 2.5
V5 N002 0 5
V6 N006 0 AC 1m
R4 N016 0 10k
R5 N013 0 200k
Q3 N003 N009 N018 0 2N5550
C4 N009 N008 10µ
R6 N009 N017 100k
V7 N020 0 2.5
V8 N003 0 5
V9 N008 0 AC 1m
C5 N012 N017 10µ
R7 N018 0 10k
R8 N017 N020 100k
Q4 0 N018 N012 0 2N3906
R9 N003 N012 10k
C6 N011 N010 10µ
R10 N011 N019 100k
V10 N021 0 2.5
V11 N010 0 AC 1m
R11 N019 N021 10k
XU1 N027 N026 N022 0 N026 TL072  ; pins 1 2 3 4 5
V12 N022 0 5
R12 N025 N027 1Meg
C7 N027 N028 10µ
C8 N026 N025 10µ
V13 N024 0 2.5
V14 N028 0 AC 1m
R13 N025 N024 1Meg
R14 N001 N013 200k
C9 N029 input 10µ
R15 N029 N030 1k
V1 N023 0 5
V15 input 0 AC 1m
C10 N031 N030 10µ
R16 N031 0 100k
R17 N030 0 1Meg
R18 N023 N030 1Meg
J1 N023 N029 N031 J113
Q5 N032 N034 N037 0 2N5550
C11 N034 input 100n
R19 N034 N036 10k
V16 N032 0 5
C12 N037 N036 10µ
R20 N037 0 10k
R21 N036 0 200k
R22 N032 N036 200k
Q6 N033 N035 N039 0 2N5550
C13 N035 input 100n
R23 N035 N038 10k
V18 N033 0 5
R24 N039 0 10k
R25 N038 0 200k
R26 N033 N038 200k
Q7 N042 N045 N049 0 2N5550
C14 N045 input 100n
R27 N045 N048 10k
V17 N042 0 5
C15 N049 N048 100µ
R29 N048 0 200k
R30 N042 N048 200k
I1 N049 0 163µ
Q8 N040 N043 N046 0 2N5550
C16 N043 input 10µ
R28 N043 N050 200k
V19 N040 0 5
C17 N051 N050 100µ
R31 N050 0 200k
R32 N040 N050 200k
I2 N051 0 1m
Q9 N040 N046 N051 0 2N5550
R33 N046 N051 100k
C18 N057 input 100n
R34 N057 N062 10k
V20 N054 0 5
C19 N063 N062 10µ
R36 N062 0 1Meg
R37 N054 N062 1Meg
J2 N054 N057 N063 J113
I3 N063 0 10m
Q10 N041 N044 N047 0 2N5550
C20 N044 input 10µ
R35 N044 N052 200k
V21 N041 0 5
R38 N052 0 200k
R39 N041 N052 200k
I4 N053 0 1m
Q11 N041 N047 N053 0 2N5550
R40 N047 N053 100k
C21 N053 N052 10µ
Q12 N055 N058 N065 0 2N5550
C22 N058 input 1µ
R41 N058 N066 1Meg
V22 N055 0 5
C23 N067 N066 10µ
R42 N066 0 200k
R43 N055 N066 200k
I5 N067 0 1m
Q13 N055 N065 N067 0 2N5550
R44 N065 N067 100k
XU2 N064 N061 N056 0 N061 TL072  ; pins 1 2 3 4 5
V23 N056 0 5
R45 N060 N064 1Meg
C24 N064 input 1µ
C25 N061 N060 1µ
V24 N059 0 2.5
R46 N060 N059 1Meg
C26 N075 input 100n
R47 N075 N080 10Meg
V25 N070 0 5
C27 N081 N080 10µ
R48 N080 0 10Meg
R49 N070 N080 10Meg
J3 N070 N075 N081 J113
I6 N081 0 1m
C28 N069 input 100n
R50 N069 N071 10Meg
V26 N068 0 5
C29 N072 N071 20µ
R51 N071 0 10Meg
R52 N068 N071 10Meg
J4 N068 N069 N073 J113
I7 N072 0 1m
Q14 N068 N073 N072 0 2N5550
C30 N085 input 100n
V27 N079 0 5
C31 N089 NC_01 100µ
R54 N090 0 10Meg
R55 N079 N090 10Meg
J5 N079 N085 N089 J113
I8 N089 0 1m
C32 N076 input 100n
R53 N076 N082 10Meg
V28 N074 0 5
C33 out+ N082 10µ
R56 N082 0 10Meg
R57 N074 N082 10Meg
J6 N074 N076 out+ J113
Q15 out+ N084 N086 0 2N5550
R58 N086 0 220
D2 N084 N087 BAV99HM
D1 N087 0 BAV99HM
R59 N074 N084 10k
C34 N092 input- 100n
R60 N092 N093 10Meg
V29 N091 0 5
C35 out- N093 10µ
R61 N093 0 10Meg
R62 N091 N093 10Meg
J7 N091 N092 out- J113
Q16 out- N094 N095 0 2N5550
R63 N095 0 220
D3 N094 N096 BAV99HM
D4 N096 0 BAV99HM
R64 N091 N094 10k
V30 input- 0 AC 1m 180
XU3 N083 N077 N074 0 N078 NE5532  ; pins In+ In- V+ V- OUT
R65 N083 out+ 1k
R66 out- N077 1k
R67 0 N083 200k
R68 N078 N077 100k
R69 N074 N083 200k
.model D D
.lib standard.dio
.model NPN NPN
.model PNP PNP
.lib standard.bjt
.model NJF NJF
.model PJF PJF
.lib standard.jft
.ac dec 100 0.01 10k
.lib TL072.cir
.backanno
.end